# Altium schematic sheet Power.SchDoc (part 1 of 2)
size A3; SheetNumber: 6; SheetTotal: 6
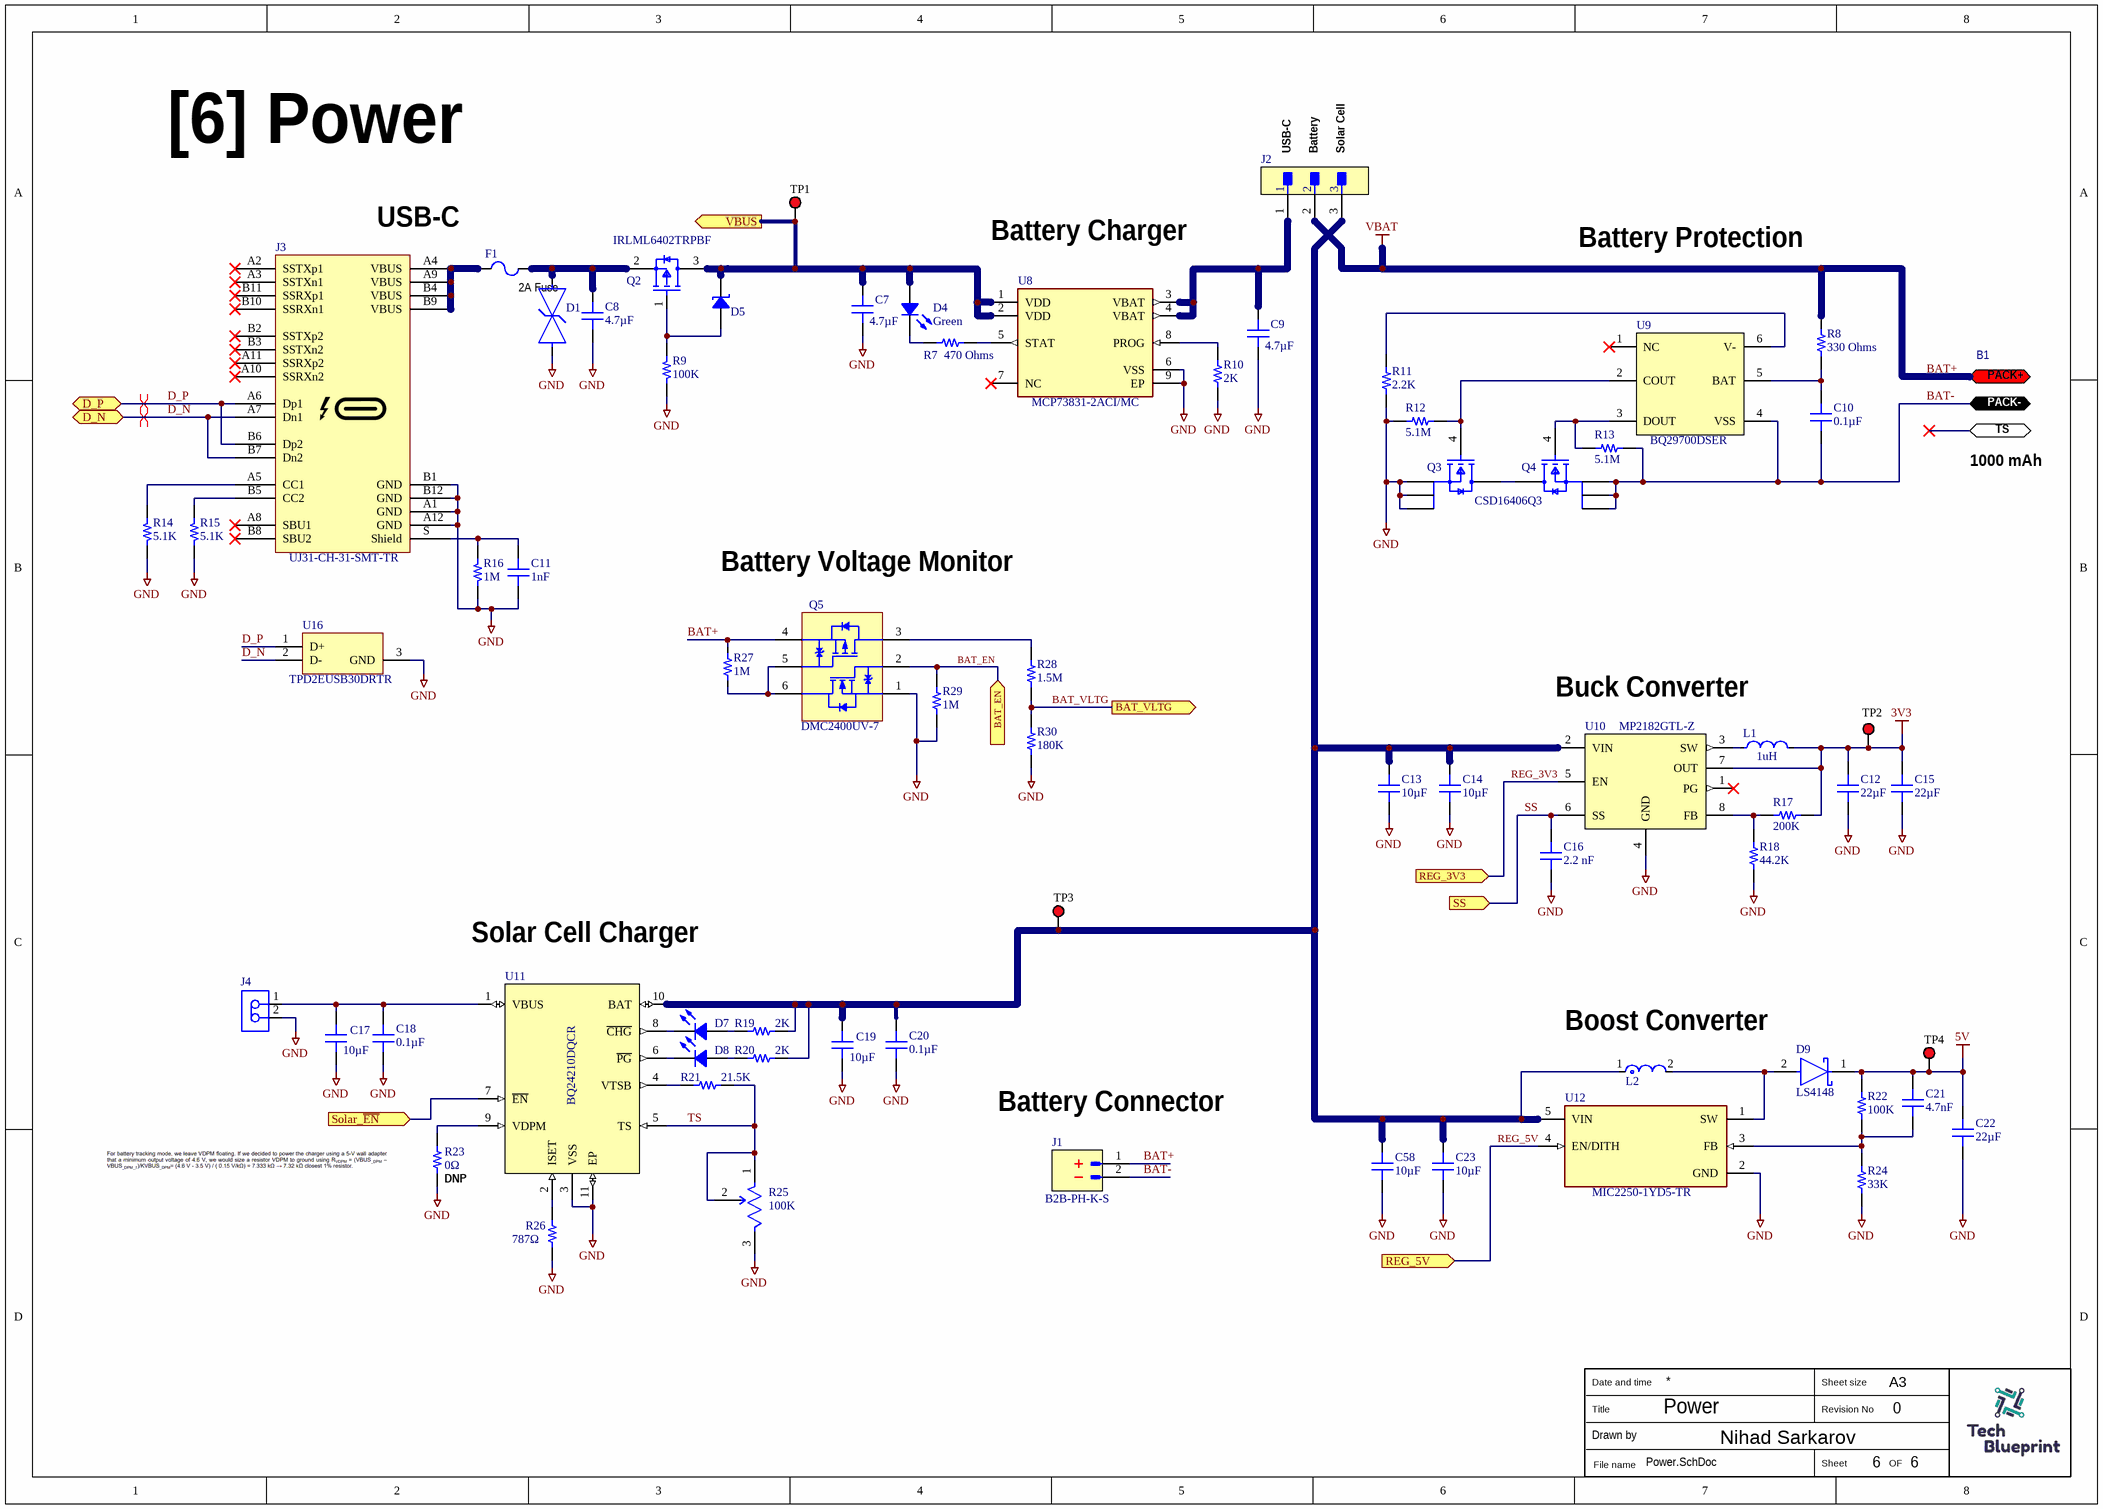
[diagram p0: Power.SchDoc]

## Parts
B1  Battery  [1000 mAh battery]  (value not drawn)
C7  4.7µF  [CAP 0805_2012]
C8  4.7µF  [CAP 0805_2012]
C9  4.7µF  [CAP 0805_2012]
C10  0.1µF  [CAP 0805_2012]
C11  Capacitance: 1nF  [CAP 0805_2012]  (hidden comment: 1000 pF)
C12  22µF  [CAP 0805_2012]
C13  10µF  [CAP 0805_2012]
C14  10µF  [CAP 0805_2012]
C15  22µF  [CAP 0805_2012]
C16  Capacitance: 2.2 nF  [CAP 0603_1608]  (hidden comment: 2200 pF)
C17  10µF  [CAP 0805_2012]
C18  0.1µF  [CAP 0805_2012]
C19  10µF  [CAP 0805_2012]
C20  0.1µF  [CAP 0805_2012]
C21  Capacitance: 4.7nF  [CAP 0603_1608]  (hidden comment: 4700 pF)
C22  22µF  [CAP 0805_2012]
C23  10µF  [CAP 0805_2012]
C58  10µF  [CAP 0805_2012]
D1  EZA-EG3A50AV  [FP-EZAEG3A-MFG]  (value not drawn)
D4  Green  [LED 0603_1608 GREEN]
D5  PZU3.0B2A,115  [SOD323]  (value not drawn)
D7  Red  [LED 0603_1608 RED]  (value not drawn)
D8  Green  [LED 0603_1608 GREEN]  (value not drawn)
D9  LS4148  [FP-6_560-5006_01-4-MFG]
F1  3413.0219.22  [FUSE 1206_3216 0.6MM]  (value not drawn)
J1  B2B-PH-K-S  [JST_B2B-PH-K-S]
J2  87224-3  [FP-87224-3-MFG]  (value not drawn)
J3  UJ31-CH-31-SMT-TR  [CUI UJ31-CH-31-SMT-TR]
J4  640456-2  [TECO-640456-2_V]  (value not drawn)
L1  Inductance: 1uH  [FP-DFE252012C-IPC_C]  (hidden comment: 1239AS-H-1R0M=P2)
L2  LPS4018-104MRB  [FP-LPS4018-MFG]  (value not drawn)
Q2  IRLML6402TRPBF  [FP-Micro3-MFG]
Q3  CSD16406Q3  [FP-DQG0008A-MFG]  (value not drawn)
Q4  CSD16406Q3  [FP-DQG0008A-MFG]
Q5  DMC2400UV-7  [DIOD-SOT563-6_V]
R7  470 Ohms  [RES 0603_1608]
R8  330 Ohms  [RES 0805_2012]
R9  100K  [RES 0805_2012]
R10  2K  [YAGEO RES 0603_1608]
R11  2.2K  [RES 0805_2012]
R12  5.1M  [RES 0805_2012]
R13  5.1M  [RES 0805_2012]
R14  5.1K  [YAGEO RES RK73 RS73 SG73 0805_2012]
R15  5.1K  [YAGEO RES RK73 RS73 SG73 0805_2012]
R16  1M  [RES 0805_2012]
R17  200K  [YAGEO RES 0805_2012]
R18  44.2K  [YAGEO RES RK73 RS73 SG73 0805_2012]
R19  2K  [RES 0603_1608]
R20  2K  [RES 0603_1608]
R21  21.5K  [RES 0805_2012]
R22  100K  [RES 0805_2012]
R23  0Ω  [RES 0805_2012]
R24  33K  [RES 0805_2012]
R25  Resistance: 100K  [FP-TC33X-2-MFG]  (hidden comment: TC33X-2-104E)
R26  787Ω  [RES 0805_2012]
R27  1M  [RES 0805_2012]
R28  1.5M  [RES 0805_2012]
R29  1M  [RES 0805_2012]
R30  180K  [RES 0805_2012]
TP1  5010  [KSTN-5010_V]  (value not drawn)
TP2  5010  [KSTN-5010_V]  (value not drawn)
TP3  5010  [KSTN-5010_V]  (value not drawn)
TP4  5010  [KSTN-5010_V]  (value not drawn)
U8  MCP73831-2ACI/MC  [FP-C04-123-MFG]
U9  BQ29700DSER  [FP-DSE0006A-IPC_A]
U10  MP2182GTL-Z  [SOT583_MP2182_MNP]
U11  BQ24210DQCR  [SON50P300X200X80-11N]
U12  MIC2250-1YD5-TR  [FP-MIC2250-1YD5-TR-IPC_C]
U16  TPD2EUSB30DRTR  [DRT0003A]

## Ports
BAT_EN (in, see MCU[4C]), BAT_VLTG (out, see MCU[4C]), D_N (bidir, see MCU[1C]), D_P (bidir, see MCU[1C]), REG_3V3 (in, see MCU[6B]), REG_5V (in, see MCU[6B]), Solar_~{EN} (in, see MCU[4C]), SS (in, see MCU[4A]), VBUS (out, see MCU[2C])

## Nets
3V3: C12.2 C15.2 L1.2 R17.1 TP2.1 U10.7(OUT)
5V: C21.2 C22.2 D9.1(C) R22.2 TP4.1
BAT+: B1.?1 J1.1 J2.2 Q5.4(S2) R8.2 R27.1  [also labelled VBAT]
GND: C7.1 C8.1 C9.1 C11.1 C12.1 C13.1 C14.1 C15.1 C16.1 C17.1 C18.1 C19.1 C20.1 C22.1 C23.1 C58.1 D1.1 J3.A1(GND) J3.A12(GND) J3.B1(GND) J3.B12(GND) J4.2 Q3.1(S) Q3.2(S) Q3.3(S) Q5.1(S1) R9.1 R10.1 R11.1 R12.1 R14.1 R15.1 R16.1 R18.1 R23.1 R24.1 R25.3(CW) R26.1 R29.2 R30.1 U8.6(VSS) U8.9(EP) U10.4(GND) U11.3(VSS) U11.11(EP) U12.2(GND) U16.3(GND)
BAT-: B1.?2 C10.1 J1.2 Q4.1(S) Q4.2(S) Q4.3(S) R13.2 U9.4(VSS)
BAT_EN: Q5.2(G1) R29.1 ; port BAT_EN
BAT_VLTG: R28.1 R30.2 ; port BAT_VLTG
D_N: J3.A7(Dn1) J3.B7(Dn2) U16.2(D-) ; port D_N
D_P: J3.A6(Dp1) J3.B6(Dp2) U16.1(D+) ; port D_P
REG_3V3: U10.5(EN) ; port REG_3V3
REG_5V: U12.4(EN/DITH) ; port REG_5V
Solar_~{EN}: U11.7(~{EN}) ; port Solar_~{EN}
SS: C16.2 U10.6(SS) ; port SS
TS: R21.1 R25.1(CCW) R25.2(WIPER) U11.5(TS)
VBUS: C7.2 D4.1 D5.2 Q2.3(D) TP1.1 U8.1(VDD) U8.2(VDD) ; port VBUS
NetC8_2: C8.2 D1.2 F1.1 Q2.2(S)
NetC9_2: C9.2 J2.1 U8.3(VBAT) U8.4(VBAT)
NetC10_2: C10.2 R8.1 U9.5(BAT)
NetC11_2: C11.2 J3.S(Shield) R16.2
NetC13_2: C13.2 C14.2 C19.2 C20.2 C23.2 C58.2 J2.3 L2.1 R19.2 R20.2 TP3.1 U10.2(VIN) U11.10(BAT) U12.5(VIN)
NetC17_2: C17.2 C18.2 J4.1 U11.1(VBUS)
NetC21_1: C21.1 R22.1 R24.2 U12.3(FB)
NetD4_2: D4.2 R7.1
NetD5_1: D5.1 Q2.1(G) R9.2
NetD7_1: D7.1 R19.1
NetD7_2: D7.2 U11.8(~{CHG})
NetD8_1: D8.1 R20.1
NetD8_2: D8.2 U11.6(~{PG})
NetD9_2: D9.2(A) L2.2 U12.1(SW)
NetF1_2: F1.2 J3.A4(VBUS) J3.A9(VBUS) J3.B4(VBUS) J3.B9(VBUS)
NetJ3_A5: J3.A5(CC1) R14.2
NetJ3_B5: J3.B5(CC2) R15.2
NetL1_1: L1.1 U10.3(SW)
NetQ3_4: Q3.4(G) R12.2 U9.2(COUT)
NetQ3_5-6-7-8: Q3.5-6-7-8(D) Q4.5-6-7-8(D)
NetQ4_4: Q4.4(G) R13.1 U9.3(DOUT)
NetQ5_3: Q5.3(D2) R28.2
NetQ5_5: Q5.5(G2) Q5.6(D1) R27.2
NetR7_2: R7.2 U8.5(STAT)
NetR10_2: R10.2 U8.8(PROG)
NetR11_2: R11.2 U9.6(V-)
NetR17_2: R17.2 R18.2 U10.8(FB)
NetR21_2: R21.2 U11.4(VTSB)
NetR23_2: R23.2 U11.9(VDPM)
NetR26_2: R26.2 U11.2(ISET)

Not connected (* = marked no-connect by the designer): B1 ?3*; J3 A2(SSTXp1)* A3(SSTXn1)* A8(SBU1)* A10(SSRXn2)* A11(SSRXp2)* B2(SSTXp2)* B3(SSTXn2)* B8(SBU2)* B10(SSRXn1)* B11(SSRXp1)*; U8 7(NC)*; U9 1(NC)*; U10 1(PG)*

## Layout directives
differential pair; differential pair class USB_90: D_N, D_P

## Notes on the sheet
- [6] Power
- (near J2) USB-C
- (near J2) Battery
- (near J2) Solar Cell
- (near J3) USB-C
- Battery Charger
- (near F1) 2A Fuse
- Battery Protection
- (near B1) 1000 mAh
- Battery Voltage Monitor
- Buck Converter
- Solar Cell Charger
- Boost Converter
- (near J1) Battery Connector
- (near R23) DNP
- Power
- 0
- 6
- Date and time
- Sheet size
- A3
- Title
- Drawn by
- File name
- Nihad Sarkarov
- Sheet
- Revision No
- OF
- (in symbol Battery) PACK+; PACK-; TS